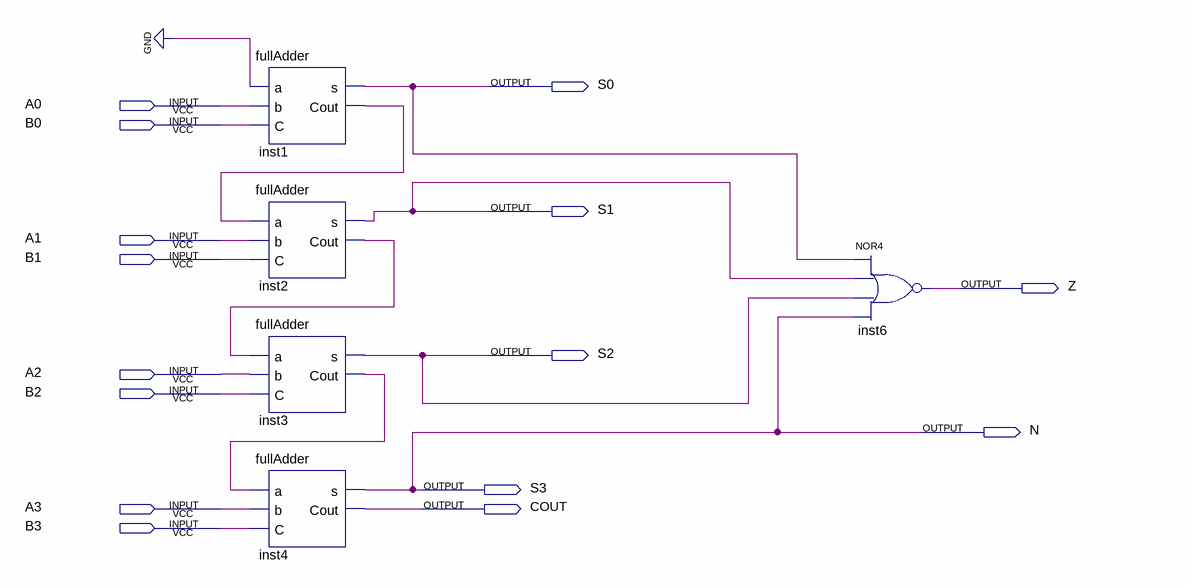
[diagram p0: schematic sheet]
// Quartus schematic 4_bitAdder.bdf as structural Verilog: 5 symbols, 15 pins
module \4_bitAdder  (
  input  A0,
  input  B0,
  input  A1,
  input  B1,
  input  A2,
  input  B2,
  input  A3,
  input  B3,
  output S0,
  output S1,
  output Z,
  output S2,
  output N,
  output S3,
  output COUT
);

  wire inst1_cout, inst2_cout, inst3_cout;

  fullAdder inst1 (.a(1'b0), .b(A0), .C(B0), .s(S0), .Cout(inst1_cout));
  fullAdder inst2 (.a(inst1_cout), .b(A1), .C(B1), .s(S1), .Cout(inst2_cout));
  fullAdder inst3 (.a(inst2_cout), .b(A2), .C(B2), .s(S2), .Cout(inst3_cout));
  fullAdder inst4 (.a(inst3_cout), .b(A3), .C(B3), .s(N), .Cout(COUT));
  nor inst6 (Z, S0, S1, S2, N);

  assign S3 = N;
endmodule
